# EAGLE schematic agatram128 (EAGLE 7.5.0)
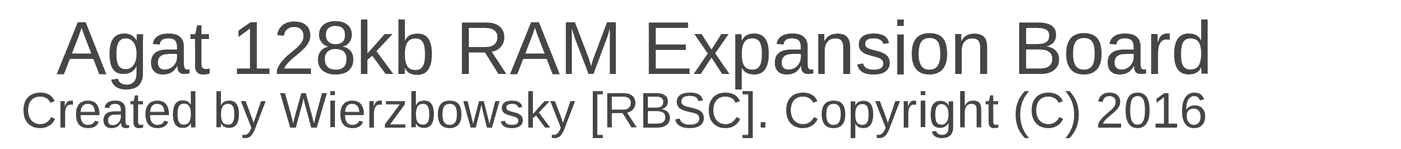
[diagram p0: schematic, sheet 1, part 1 of 3]
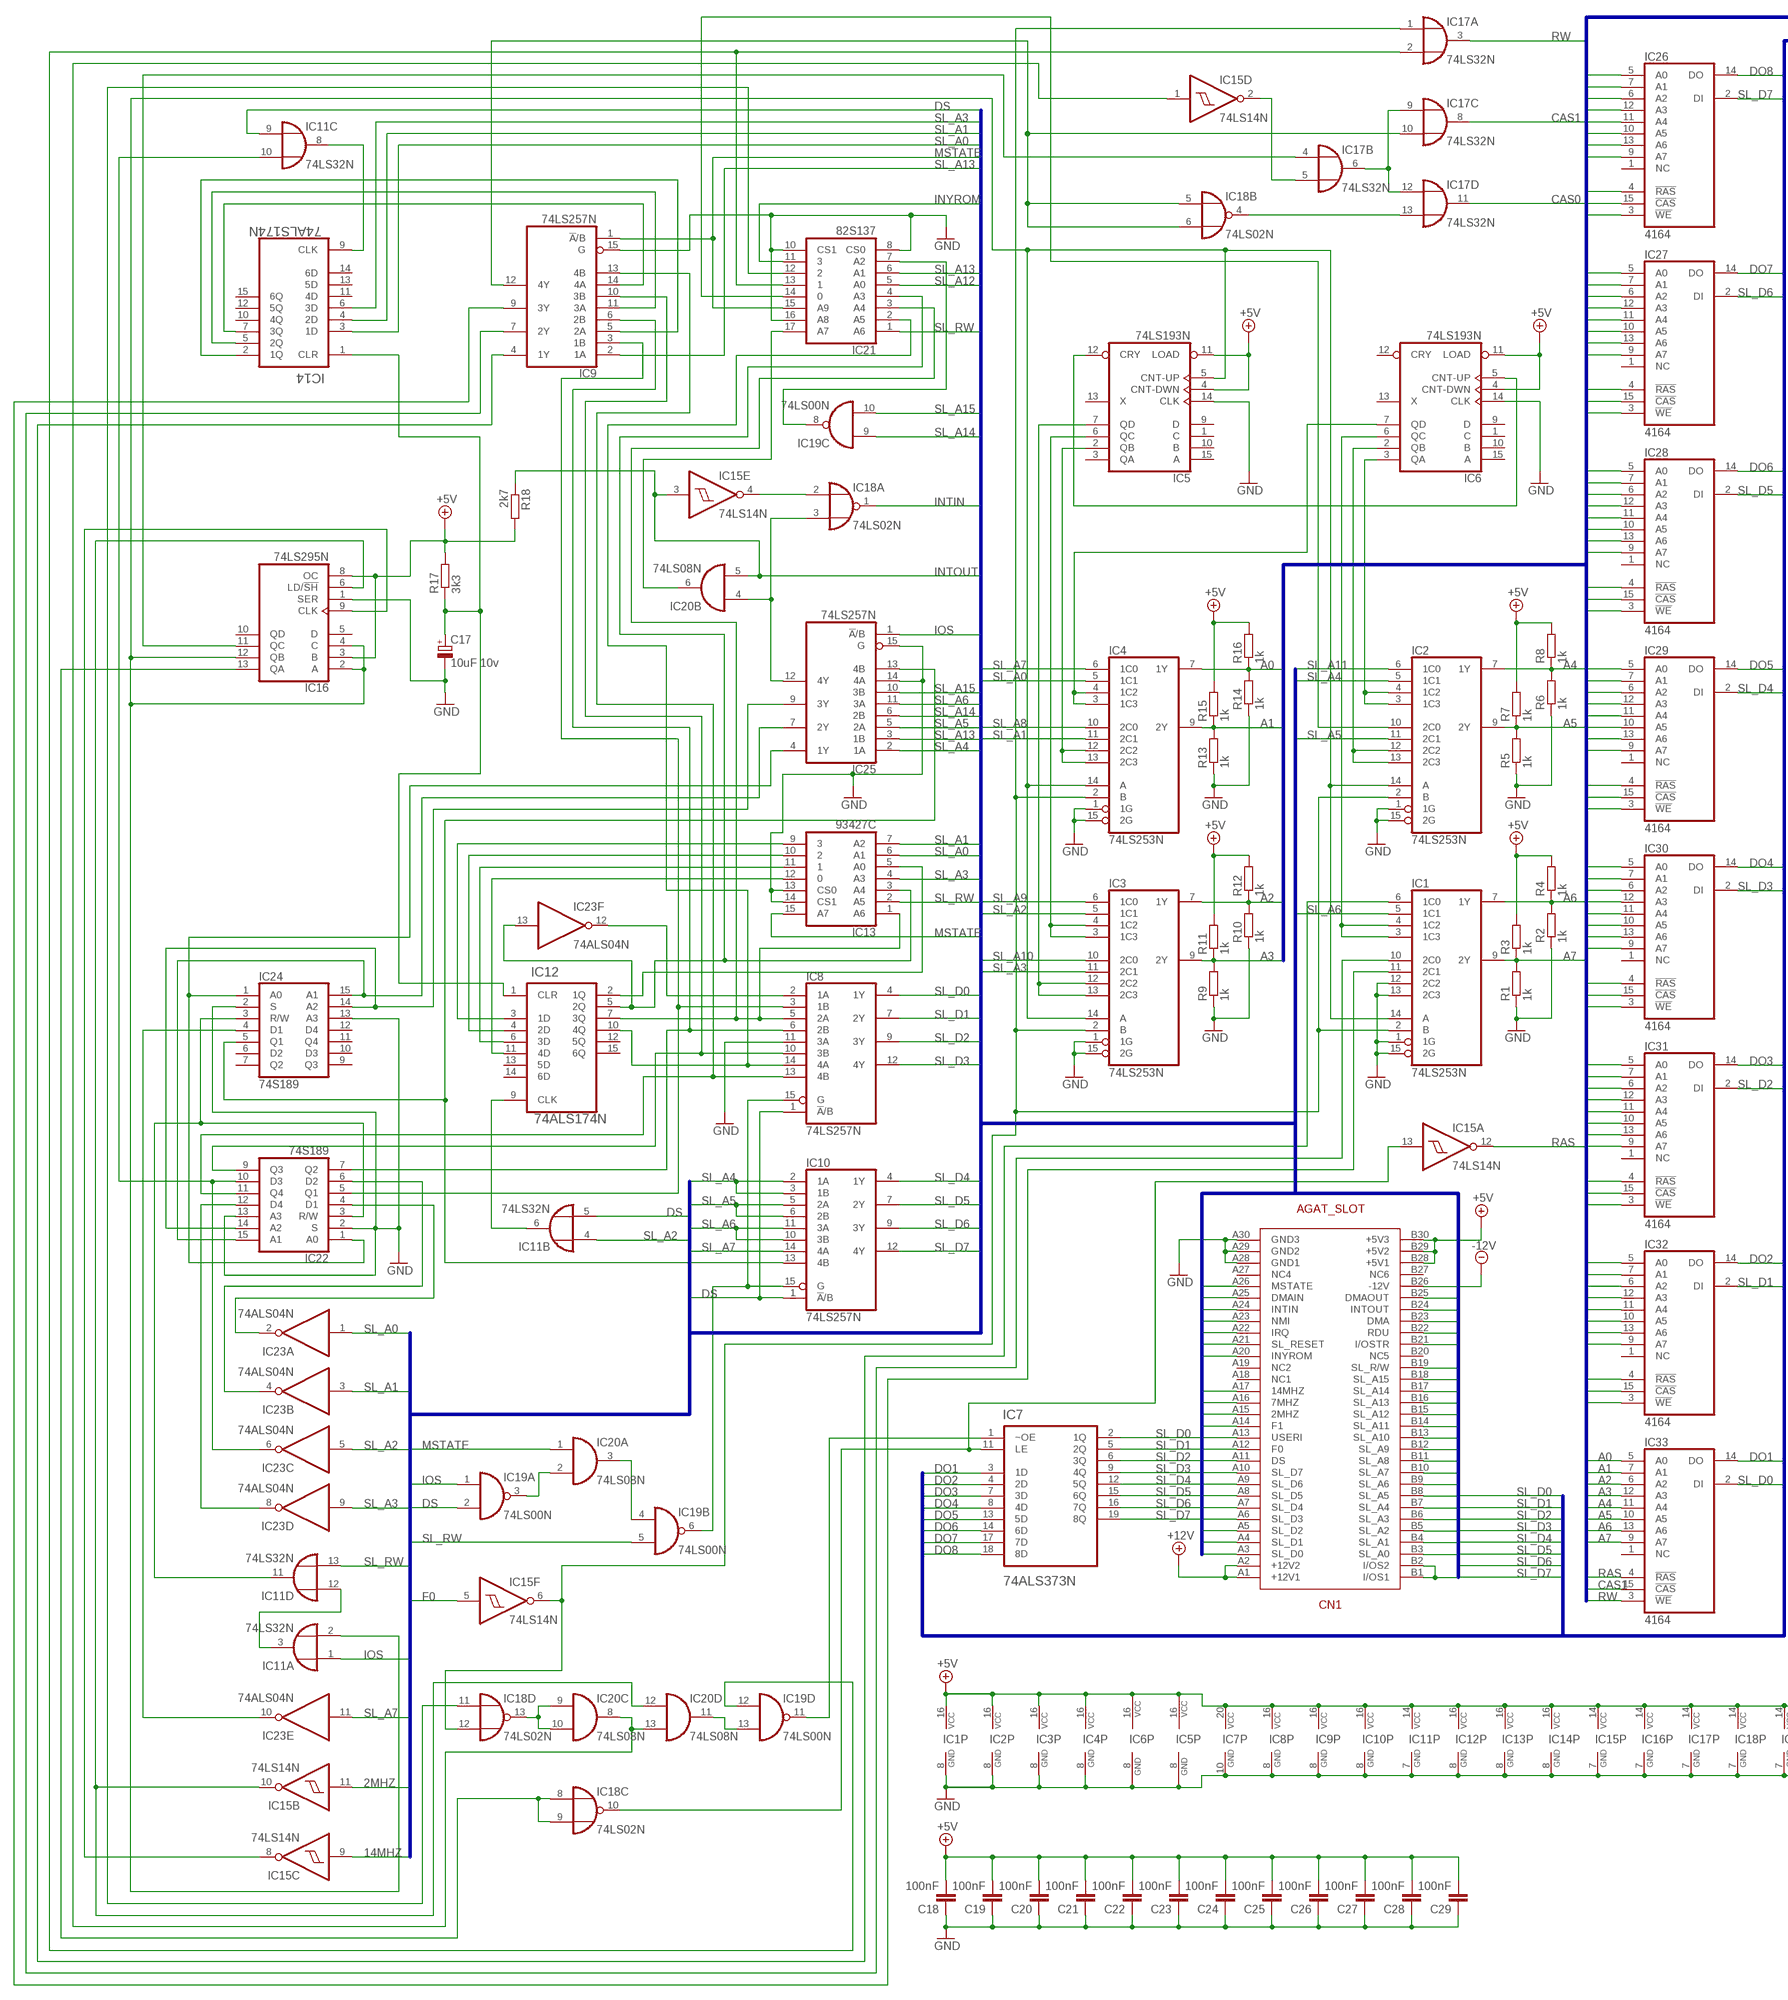
[diagram p1: schematic, sheet 1, part 2 of 3]
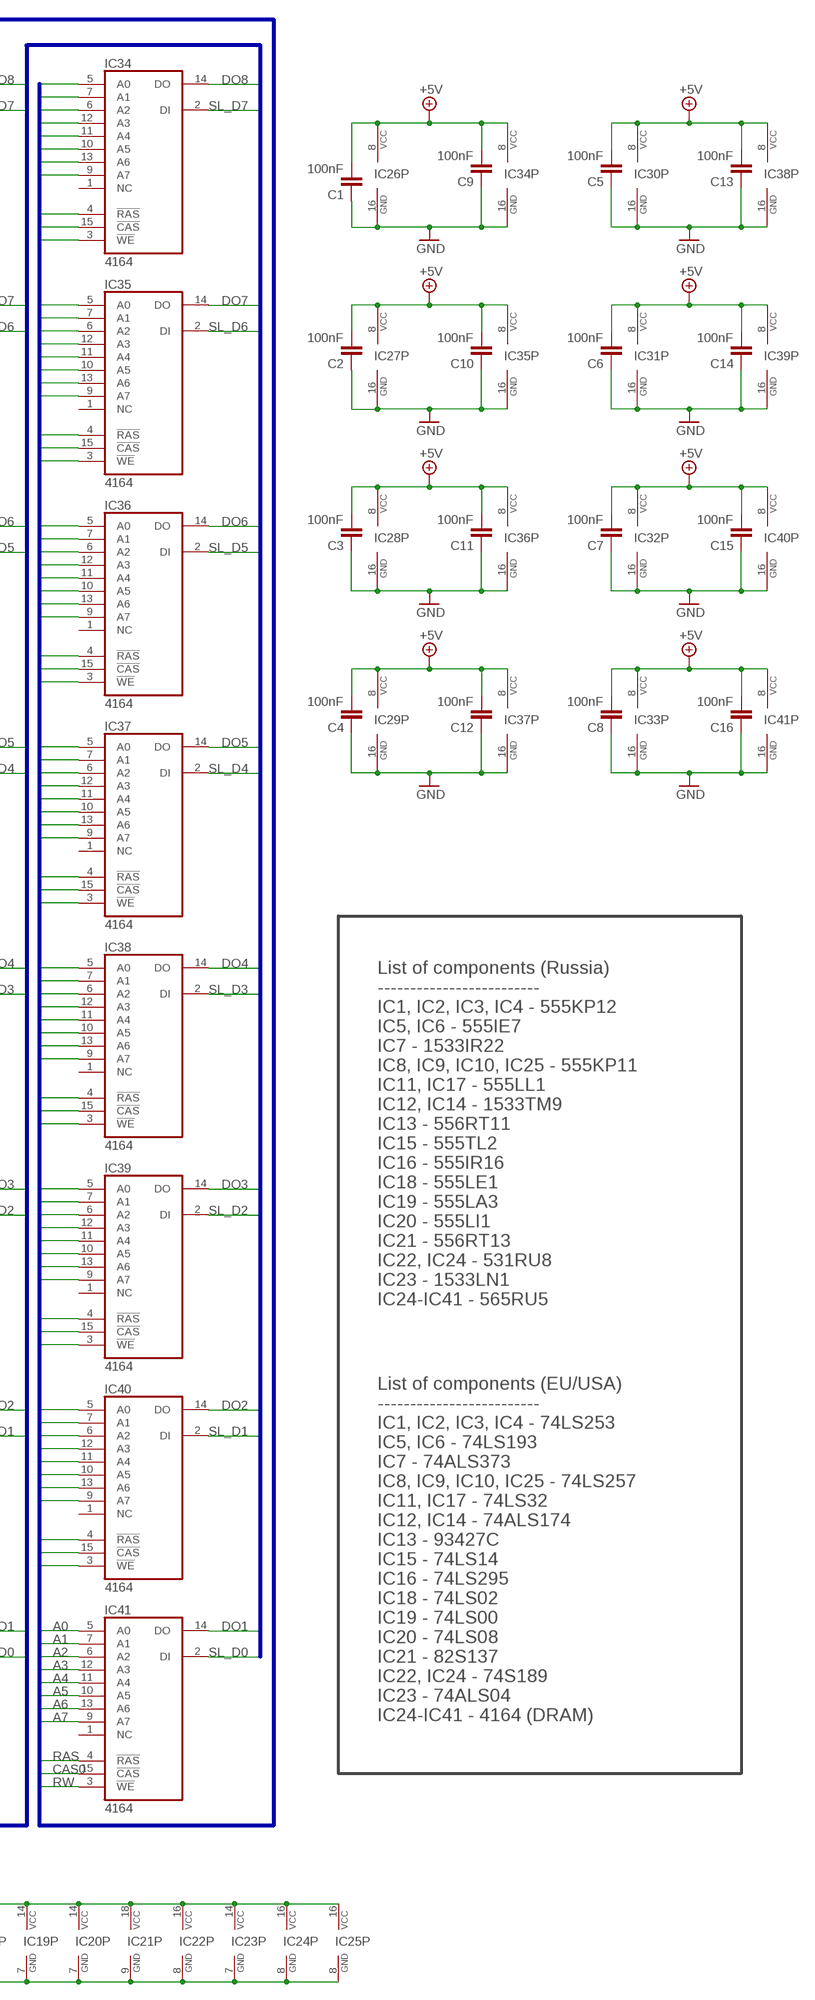
[diagram p2: schematic, sheet 1, part 3 of 3]

## Parts
C1  100nF  C-EU050-025X075  [C050-025X075]
C2  100nF  C-EU050-025X075  [C050-025X075]
C3  100nF  C-EU050-025X075  [C050-025X075]
C4  100nF  C-EU050-025X075  [C050-025X075]
C5  100nF  C-EU050-025X075  [C050-025X075]
C6  100nF  C-EU050-025X075  [C050-025X075]
C7  100nF  C-EU050-025X075  [C050-025X075]
C8  100nF  C-EU050-025X075  [C050-025X075]
C9  100nF  C-EU050-025X075  [C050-025X075]
C10  100nF  C-EU050-025X075  [C050-025X075]
C11  100nF  C-EU050-025X075  [C050-025X075]
C12  100nF  C-EU050-025X075  [C050-025X075]
C13  100nF  C-EU050-025X075  [C050-025X075]
C14  100nF  C-EU050-025X075  [C050-025X075]
C15  100nF  C-EU050-025X075  [C050-025X075]
C16  100nF  C-EU050-025X075  [C050-025X075]
C17  10uF 10v  CPOL-EUE15-5AXIAL  [E15-5]
C18  100nF  C-EU050-025X075  [C050-025X075]
C19  100nF  C-EU050-025X075  [C050-025X075]
C20  100nF  C-EU050-025X075  [C050-025X075]
C21  100nF  C-EU050-025X075  [C050-025X075]
C22  100nF  C-EU050-025X075  [C050-025X075]
C23  100nF  C-EU050-025X075  [C050-025X075]
C24  100nF  C-EU050-025X075  [C050-025X075]
C25  100nF  C-EU050-025X075  [C050-025X075]
C26  100nF  C-EU050-025X075  [C050-025X075]
C27  100nF  C-EU050-025X075  [C050-025X075]
C28  100nF  C-EU050-025X075  [C050-025X075]
C29  100nF  C-EU050-025X075  [C050-025X075]
CN1  AGAT_SLOT  AGAT_CON  [AGAT_CONP]
IC1  74LS253N  [DIL16]
IC2  74LS253N  [DIL16]
IC3  74LS253N  [DIL16]
IC4  74LS253N  [DIL16]
IC5  74LS193N  [DIL16]
IC6  74LS193N  [DIL16]
IC7  74ALS373N  [DIL20]
IC8  74LS257N  [DIL16]
IC9  74LS257N  [DIL16]
IC10  74LS257N  [DIL16]
IC11  74LS32N  [DIL14]
IC12  74ALS174N  [DIL16]
IC13  93427C  [DIL16]
IC14  74ALS174N  [DIL16]
IC15  74LS14N  [DIL14]
IC16  74LS295N  [DIL14]
IC17  74LS32N  [DIL14]
IC18  74LS02N  [DIL14]
IC19  74LS00N  [DIL14]
IC20  74LS08N  [DIL14]
IC21  82S137  [DIL18]
IC22  74S189  [DIL16]
IC23  74ALS04N  [DIL14]
IC24  74S189  [DIL16]
IC25  74LS257N  [DIL16]
IC26  4164  [DIL16]
IC27  4164  [DIL16]
IC28  4164  [DIL16]
IC29  4164  [DIL16]
IC30  4164  [DIL16]
IC31  4164  [DIL16]
IC32  4164  [DIL16]
IC33  4164  [DIL16]
IC34  4164  [DIL16]
IC35  4164  [DIL16]
IC36  4164  [DIL16]
IC37  4164  [DIL16]
IC38  4164  [DIL16]
IC39  4164  [DIL16]
IC40  4164  [DIL16]
IC41  4164  [DIL16]
R1  1k  R-EU_0204/7  [0204/7]
R2  1k  R-EU_0204/7  [0204/7]
R3  1k  R-EU_0204/7  [0204/7]
R4  1k  R-EU_0204/7  [0204/7]
R5  1k  R-EU_0204/7  [0204/7]
R6  1k  R-EU_0204/7  [0204/7]
R7  1k  R-EU_0204/7  [0204/7]
R8  1k  R-EU_0204/7  [0204/7]
R9  1k  R-EU_0204/7  [0204/7]
R10  1k  R-EU_0204/7  [0204/7]
R11  1k  R-EU_0204/7  [0204/7]
R12  1k  R-EU_0204/7  [0204/7]
R13  1k  R-EU_0204/7  [0204/7]
R14  1k  R-EU_0204/7  [0204/7]
R15  1k  R-EU_0204/7  [0204/7]
R16  1k  R-EU_0204/7  [0204/7]
R17  3k3  R-EU_0204/7  [0204/7]
R18  2k7  R-EU_0204/7  [0204/7]

## Nets
2MHZ: CN1.A15(2MHZ) IC15.11(B:I)
7MHZ: CN1.A16(7MHZ)
14MHZ: CN1.A17(14MHZ) IC15.9(C:I)
+5V: C1.2 C2.2 C3.2 C4.2 C5.2 C6.2 C7.2 C8.2 C9.2 C10.2 C11.2 C12.2 C13.2 C14.2 C15.2 C16.2 C18.2 C19.2 C20.2 C21.2 C22.2 C23.2 C24.2 C25.2 C26.2 C27.2 C28.2 C29.2 CN1.B28(+5V1) CN1.B29(+5V2) CN1.B30(+5V3) IC1.16(VCC) IC2.16(VCC) IC3.16(VCC) IC4.16(VCC) IC5.4(CNT-DWN) IC5.11(LOAD) IC5.16(VCC) IC6.4(CNT-DWN) IC6.11(LOAD) IC6.16(VCC) IC7.20(VCC) IC8.16(VCC) IC9.16(VCC) IC10.16(VCC) IC11.14(P:VCC) IC12.16(VCC) IC13.16(VCC) IC14.16(VCC) IC15.14(P:VCC) IC16.3(B) IC16.8(OC) IC16.14(VCC) IC17.14(P:VCC) IC18.14(P:VCC) IC19.14(P:VCC) IC20.14(P:VCC) IC21.18(VCC) IC22.16(VCC) IC23.14(P:VCC) IC24.16(VCC) IC25.16(VCC) IC26.8(VCC) IC27.8(VCC) IC28.8(VCC) IC29.8(VCC) IC30.8(VCC) IC31.8(VCC) IC32.8(VCC) IC33.8(VCC) IC34.8(VCC) IC35.8(VCC) IC36.8(VCC) IC37.8(VCC) IC38.8(VCC) IC39.8(VCC) IC40.8(VCC) IC41.8(VCC) R3.2 R4.2 R7.2 R8.2 R11.2 R12.2 R15.2 R16.2 R17.2 R18.2
+12V: CN1.A1(+12V1) CN1.A2(+12V2)
-12V: CN1.B26(-12V)
A0: IC4.7(1Y) IC26.5(A0) IC27.5(A0) IC28.5(A0) IC29.5(A0) IC30.5(A0) IC31.5(A0) IC32.5(A0) IC33.5(A0) IC34.5(A0) IC35.5(A0) IC36.5(A0) IC37.5(A0) IC38.5(A0) IC39.5(A0) IC40.5(A0) IC41.5(A0) R14.2 R16.1
A1: IC4.9(2Y) IC26.7(A1) IC27.7(A1) IC28.7(A1) IC29.7(A1) IC30.7(A1) IC31.7(A1) IC32.7(A1) IC33.7(A1) IC34.7(A1) IC35.7(A1) IC36.7(A1) IC37.7(A1) IC38.7(A1) IC39.7(A1) IC40.7(A1) IC41.7(A1) R13.2 R15.1
A2: IC3.7(1Y) IC26.6(A2) IC27.6(A2) IC28.6(A2) IC29.6(A2) IC30.6(A2) IC31.6(A2) IC32.6(A2) IC33.6(A2) IC34.6(A2) IC35.6(A2) IC36.6(A2) IC37.6(A2) IC38.6(A2) IC39.6(A2) IC40.6(A2) IC41.6(A2) R10.2 R12.1
A3: IC3.9(2Y) IC26.12(A3) IC27.12(A3) IC28.12(A3) IC29.12(A3) IC30.12(A3) IC31.12(A3) IC32.12(A3) IC33.12(A3) IC34.12(A3) IC35.12(A3) IC36.12(A3) IC37.12(A3) IC38.12(A3) IC39.12(A3) IC40.12(A3) IC41.12(A3) R9.2 R11.1
A4: IC2.7(1Y) IC26.11(A4) IC27.11(A4) IC28.11(A4) IC29.11(A4) IC30.11(A4) IC31.11(A4) IC32.11(A4) IC33.11(A4) IC34.11(A4) IC35.11(A4) IC36.11(A4) IC37.11(A4) IC38.11(A4) IC39.11(A4) IC40.11(A4) IC41.11(A4) R6.2 R8.1
A5: IC2.9(2Y) IC26.10(A5) IC27.10(A5) IC28.10(A5) IC29.10(A5) IC30.10(A5) IC31.10(A5) IC32.10(A5) IC33.10(A5) IC34.10(A5) IC35.10(A5) IC36.10(A5) IC37.10(A5) IC38.10(A5) IC39.10(A5) IC40.10(A5) IC41.10(A5) R5.2 R7.1
A6: IC1.7(1Y) IC26.13(A6) IC27.13(A6) IC28.13(A6) IC29.13(A6) IC30.13(A6) IC31.13(A6) IC32.13(A6) IC33.13(A6) IC34.13(A6) IC35.13(A6) IC36.13(A6) IC37.13(A6) IC38.13(A6) IC39.13(A6) IC40.13(A6) IC41.13(A6) R2.2 R4.1
A7: IC1.9(2Y) IC26.9(A7) IC27.9(A7) IC28.9(A7) IC29.9(A7) IC30.9(A7) IC31.9(A7) IC32.9(A7) IC33.9(A7) IC34.9(A7) IC35.9(A7) IC36.9(A7) IC37.9(A7) IC38.9(A7) IC39.9(A7) IC40.9(A7) IC41.9(A7) R1.2 R3.1
CAS0: IC17.11(D:O) IC34.15(!CAS) IC35.15(!CAS) IC36.15(!CAS) IC37.15(!CAS) IC38.15(!CAS) IC39.15(!CAS) IC40.15(!CAS) IC41.15(!CAS)
CAS1: IC17.8(C:O) IC26.15(!CAS) IC27.15(!CAS) IC28.15(!CAS) IC29.15(!CAS) IC30.15(!CAS) IC31.15(!CAS) IC32.15(!CAS) IC33.15(!CAS)
DMA: CN1.B23(DMA)
DMAIN: CN1.A25(DMAIN)
DMAOUT: CN1.B25(DMAOUT)
DO1: IC7.3(1D) IC33.14(DO) IC41.14(DO)
DO2: IC7.4(2D) IC32.14(DO) IC40.14(DO)
DO3: IC7.7(3D) IC31.14(DO) IC39.14(DO)
DO4: IC7.8(4D) IC30.14(DO) IC38.14(DO)
DO5: IC7.13(5D) IC29.14(DO) IC37.14(DO)
DO6: IC7.14(6D) IC28.14(DO) IC36.14(DO)
DO7: IC7.17(7D) IC27.14(DO) IC35.14(DO)
DO8: IC7.18(8D) IC26.14(DO) IC34.14(DO)
DS: CN1.A11(DS) IC8.1(!A!/B) IC10.1(!A!/B) IC11.5(B:I1) IC11.9(C:I0) IC19.2(A:I1)
F0: CN1.A12(F0) IC15.5(F:I)
F1: CN1.A14(F1)
GND: C1.1 C2.1 C3.1 C4.1 C5.1 C6.1 C7.1 C8.1 C9.1 C10.1 C11.1 C12.1 C13.1 C14.1 C15.1 C16.1 C17.- C18.1 C19.1 C20.1 C21.1 C22.1 C23.1 C24.1 C25.1 C26.1 C27.1 C28.1 C29.1 CN1.A28(GND1) CN1.A29(GND2) CN1.A30(GND3) IC1.1(1G) IC1.8(GND) IC1.12(2C2) IC1.13(2C3) IC1.15(2G) IC2.1(1G) IC2.8(GND) IC2.15(2G) IC3.1(1G) IC3.8(GND) IC3.15(2G) IC4.1(1G) IC4.8(GND) IC4.15(2G) IC5.8(GND) IC5.14(CLK) IC6.8(GND) IC6.14(CLK) IC7.10(GND) IC8.8(GND) IC8.11(3A) IC9.8(GND) IC9.15(G) IC10.8(GND) IC11.7(P:GND) IC12.8(GND) IC13.8(GND) IC13.13(CS0) IC13.14(CS1) IC14.8(GND) IC15.7(P:GND) IC16.1(SER) IC16.7(GND) IC17.7(P:GND) IC18.7(P:GND) IC19.7(P:GND) IC20.7(P:GND) IC21.8(CS0) IC21.9(GND) IC21.10(CS1) IC21.16(A8) IC22.2(S) IC22.8(GND) IC22.13(A3) IC23.7(P:GND) IC24.2(S) IC24.8(GND) IC24.13(A3) IC25.8(GND) IC25.14(4A) IC25.15(G) IC26.16(GND) IC27.16(GND) IC28.16(GND) IC29.16(GND) IC30.16(GND) IC31.16(GND) IC32.16(GND) IC33.16(GND) IC34.16(GND) IC35.16(GND) IC36.16(GND) IC37.16(GND) IC38.16(GND) IC39.16(GND) IC40.16(GND) IC41.16(GND) R1.1 R2.1 R5.1 R6.1 R9.1 R10.1 R13.1 R14.1
INTIN: CN1.A24(INTIN) IC18.1(A:O)
INTOUT: CN1.B24(INTOUT) IC15.3(E:I) IC20.5(B:I1) R18.1
INYROM: CN1.A20(INYROM) IC21.11
IOS: CN1.B1(I/OS1) CN1.B2(I/OS2) IC11.1(A:I0) IC19.1(A:I0) IC25.1(!A!/B)
IOSTR: CN1.B21(I/OSTR)
IRQ: CN1.A22(IRQ)
MSTATE: CN1.A26(MSTATE) IC9.1(!A!/B) IC13.15(A7) IC20.1(A:I0) IC21.15(A9)
N$1: IC17.6(B:O) IC17.9(C:I0) IC17.12(D:I0)
N$2: IC7.1(~OE) IC19.11(D:O)
N$3: IC7.11(LE) IC15.13(A:I) IC18.10(C:O)
N$4: IC19.8(C:O) IC21.7(A2)
N$5: IC8.15(G) IC10.15(G) IC19.6(B:O)
N$6: IC11.6(B:O) IC12.9(CLK)
N$7: IC12.2(1Q) IC13.5(A0)
N$8: IC12.5(2Q) IC13.3(A4) IC21.4(A3) IC23.13(F:I)
N$9: IC8.5(2A) IC12.7(3Q) IC13.1(A6) IC21.3(A4)
N$10: IC12.6(3D) IC13.11
N$11: IC8.14(4A) IC12.10(4Q) IC21.2(A5)
N$12: IC12.11(4D) IC13.12
N$13: IC12.4(2D) IC13.10
N$14: IC12.3(1D) IC13.9
N$15: IC9.14(4A) IC14.7(3Q)
N$16: IC8.2(1A) IC23.12(F:O)
N$17: IC9.11(3A) IC14.5(2Q)
N$18: IC9.5(2A) IC14.2(1Q)
N$19: IC2.10(2C0) IC21.14
N$20: IC22.4(D1) IC23.2(A:O)
N$21: IC22.6(D2) IC23.4(B:O)
N$22: IC11.10(C:I1) IC22.10(D3) IC23.6(C:O)
N$23: IC22.12(D4) IC23.8(D:O)
N$24: IC22.14(A2) IC24.14(A2) IC25.9(3Y)
N$25: IC11.11(D:O) IC22.3(R/W) IC24.3(R/W)
N$26: IC18.3(A:I1) IC20.4(B:I0) IC25.12(4Y)
N$27: IC11.8(C:O) IC14.9(CLK)
N$28: IC11.3(A:O) IC11.12(D:I0)
N$29: IC23.10(E:O) IC24.4(D1)
N$30: IC19.4(B:I0) IC20.3(A:O)
N$31: IC19.3(A:O) IC20.2(A:I1)
N$32: IC22.1(A0) IC24.1(A0) IC25.4(1Y)
N$33: IC10.13(4B) IC24.5(Q1) IC25.13(4B)
N$34: IC22.15(A1) IC24.15(A1) IC25.7(2Y)
N$35: IC15.2(D:O) IC17.5(B:I1)
N$36: IC4.12(2C2) IC4.13(2C3) IC5.2(QB)
N$37: IC3.3(1C3) IC3.4(1C2) IC5.6(QC)
N$38: IC3.12(2C2) IC3.13(2C3) IC5.7(QD)
N$39: IC5.12(CRY) IC6.5(CNT-UP)
N$40: IC2.3(1C3) IC2.4(1C2) IC6.3(QA)
N$41: IC2.12(2C2) IC2.13(2C3) IC6.2(QB)
N$42: IC1.3(1C3) IC1.4(1C2) IC6.6(QC)
N$43: IC4.3(1C3) IC4.4(1C2) IC6.7(QD)
N$44: IC1.2(B) IC2.2(B) IC3.2(B) IC4.2(B) IC15.6(F:O) IC17.1(A:I0) IC18.12(D:I1)
N$45: IC18.13(D:O) IC20.9(C:I0) IC20.10(C:I1)
N$46: IC18.11(D:I0) IC21.12
N$47: IC15.1(D:I) IC20.8(C:O) IC20.13(D:I1)
N$48: IC19.13(D:I1) IC20.11(D:O)
N$49: IC15.10(B:O) IC16.6(LD/!SH) IC20.12(D:I0)
N$50: IC15.8(C:O) IC16.9(CLK)
N$51: IC1.14(A) IC2.14(A) IC3.14(A) IC4.14(A) IC5.5(CNT-UP) IC11.2(A:I1) IC16.2(A) IC16.4(C) IC16.12(QB)
N$52: IC16.11(QC) IC17.4(B:I0)
N$53: IC17.2(A:I1) IC19.12(D:I0) IC21.13
N$54: IC16.13(QA) IC18.8(C:I0) IC18.9(C:I1)
N$55: IC15.4(E:O) IC18.2(A:I0)
N$56: IC20.6(B:O) IC21.17(A7)
N$57: IC17.13(D:I1) IC18.4(B:O)
N$58: IC9.12(4Y) IC17.10(C:I1) IC18.5(B:I0) IC18.6(B:I1)
N$59: IC1.6(1C0) IC9.4(1Y)
N$60: IC1.10(2C0) IC9.7(2Y)
N$61: IC1.11(2C1) IC9.9(3Y)
N$63: IC8.3(1B) IC9.3(1B) IC22.5(Q1)
N$64: IC8.6(2B) IC9.6(2B) IC22.7(Q2)
N$65: IC8.10(3B) IC9.10(3B) IC22.9(Q3)
N$66: IC8.13(4B) IC9.13(4B) IC22.11(Q4)
NMI: CN1.A23(NMI)
RAS: IC15.12(A:O) IC26.4(!RAS) IC27.4(!RAS) IC28.4(!RAS) IC29.4(!RAS) IC30.4(!RAS) IC31.4(!RAS) IC32.4(!RAS) IC33.4(!RAS) IC34.4(!RAS) IC35.4(!RAS) IC36.4(!RAS) IC37.4(!RAS) IC38.4(!RAS) IC39.4(!RAS) IC40.4(!RAS) IC41.4(!RAS)
RDU: CN1.B22(RDU)
RES: C17.+ IC12.1(CLR) IC14.1(CLR) R17.1
RW: IC17.3(A:O) IC26.3(!WE) IC27.3(!WE) IC28.3(!WE) IC29.3(!WE) IC30.3(!WE) IC31.3(!WE) IC32.3(!WE) IC33.3(!WE) IC34.3(!WE) IC35.3(!WE) IC36.3(!WE) IC37.3(!WE) IC38.3(!WE) IC39.3(!WE) IC40.3(!WE) IC41.3(!WE)
SL_A0: CN1.B3(SL_A0) IC4.5(1C1) IC13.6(A1) IC14.3(1D) IC23.1(A:I)
SL_A1: CN1.B4(SL_A1) IC4.11(2C1) IC13.7(A2) IC14.4(2D) IC23.3(B:I)
SL_A2: CN1.B5(SL_A2) IC3.5(1C1) IC11.4(B:I0) IC23.5(C:I)
SL_A3: CN1.B6(SL_A3) IC3.11(2C1) IC13.4(A3) IC14.6(3D) IC23.9(D:I)
SL_A4: CN1.B7(SL_A4) IC2.5(1C1) IC10.2(1A) IC10.3(1B) IC25.2(1A)
SL_A5: CN1.B8(SL_A5) IC2.11(2C1) IC10.5(2A) IC10.6(2B) IC25.5(2A)
SL_A6: CN1.B9(SL_A6) IC1.5(1C1) IC10.10(3B) IC10.11(3A) IC25.11(3A)
SL_A7: CN1.B10(SL_A7) IC4.6(1C0) IC10.14(4A) IC23.11(E:I)
SL_A8: CN1.B11(SL_A8) IC4.10(2C0)
SL_A9: CN1.B12(SL_A9) IC3.6(1C0)
SL_A10: CN1.B13(SL_A10) IC3.10(2C0)
SL_A11: CN1.B14(SL_A11) IC2.6(1C0)
SL_A12: CN1.B15(SL_A12) IC21.5(A0)
SL_A13: CN1.B16(SL_A13) IC9.2(1A) IC21.6(A1) IC25.3(1B)
SL_A14: CN1.B17(SL_A14) IC19.9(C:I0) IC25.6(2B)
SL_A15: CN1.B18(SL_A15) IC19.10(C:I1) IC25.10(3B)
SL_D0: CN1.A3(SL_D0) IC7.2(1Q) IC8.4(1Y) IC33.2(DI) IC41.2(DI)
SL_D1: CN1.A4(SL_D1) IC7.5(2Q) IC8.7(2Y) IC32.2(DI) IC40.2(DI)
SL_D2: CN1.A5(SL_D2) IC7.6(3Q) IC8.9(3Y) IC31.2(DI) IC39.2(DI)
SL_D3: CN1.A6(SL_D3) IC7.9(4Q) IC8.12(4Y) IC30.2(DI) IC38.2(DI)
SL_D4: CN1.A7(SL_D4) IC7.12(5Q) IC10.4(1Y) IC29.2(DI) IC37.2(DI)
SL_D5: CN1.A8(SL_D5) IC7.15(6Q) IC10.7(2Y) IC28.2(DI) IC36.2(DI)
SL_D6: CN1.A9(SL_D6) IC7.16(7Q) IC10.9(3Y) IC27.2(DI) IC35.2(DI)
SL_D7: CN1.A10(SL_D7) IC7.19(8Q) IC10.12(4Y) IC26.2(DI) IC34.2(DI)
SL_RESET: CN1.A21(SL_RESET)
SL_RW: CN1.B19(SL_R/W) IC11.13(D:I1) IC13.2(A5) IC19.5(B:I1) IC21.1(A6)
USERI: CN1.A13(USERI)
Unconnected: CN1.A18(NC1) CN1.A19(NC2) CN1.A27(NC4) CN1.B20(NC5) CN1.B27(NC6) IC5.1(C) IC5.3(QA) IC5.9(D) IC5.10(B) IC5.13(X) IC5.15(A) IC6.1(C) IC6.9(D) IC6.10(B) IC6.12(CRY) IC6.13(X) IC6.15(A) IC12.12(5Q) IC12.13(5D) IC12.14(6D) IC12.15(6Q) IC14.10(4Q) IC14.11(4D) IC14.12(5Q) IC14.13(5D) IC14.14(6D) IC14.15(6Q) IC16.5(D) IC16.10(QD) IC24.6(D2) IC24.7(Q2) IC24.9(Q3) IC24.10(D3) IC24.11(Q4) IC24.12(D4) IC26.1(NC) IC27.1(NC) IC28.1(NC) IC29.1(NC) IC30.1(NC) IC31.1(NC) IC32.1(NC) IC33.1(NC) IC34.1(NC) IC35.1(NC) IC36.1(NC) IC37.1(NC) IC38.1(NC) IC39.1(NC) IC40.1(NC) IC41.1(NC)

## Buses
A0,A1,A2,A3,A4,A5,A6,A7,RAS,RW,CAS0,CAS1
DMAIN,INTIN,NMI,IRQ,SL_RESET,INYROM,14MHZ,7MHZ,2MHZ,F1,USERI,F0,DS,SL_D0,SL_D1,SL_D2,SL_D3,SL_D4,SL_D5,SL_D6,SL_D7,IOS,SL_A0,SL_A1,SL_A2,SL_A3,SL_A4,SL_A5,SL_A6,SL_A7,SL_A8,SL_A9,SL_A10,SL_A11,SL_A12,SL_A13,SL_A14,SL_A15,SL_RW,IOSTR,RDU,DMA,INTOUT,DMAOUT,MSTATE
DO1,DO2,DO3,DO4,DO5,DO6,DO7,DO8,SL_D0,SL_D1,SL_D2,SL_D3,SL_D4,SL_D5,SL_D6,SL_D7
SL_A0,SL_A1,SL_A2,SL_A3,SL_A4,SL_A5,SL_A6,SL_A7,SL_A8,SL_A9,SL_A10,SL_A11,SL_A12,SL_A13,SL_A14,SL_A15

## Notes on the sheet
- Agat 128kb RAM Expansion Board
- Created by Wierzbowsky [RBSC]. Copyright (C) 2016
- List of components (Russia)
  -------------------------
  IC1, IC2, IC3, IC4 - 555KP12
  IC5, IC6 - 555IE7
  IC7 - 1533IR22
  IC8, IC9, IC10, IC25 - 555KP11
  IC11, IC17 - 555LL1
  IC12, IC14 - 1533TM9
  IC13 - 556RT11
  IC15 - 555TL2
  IC16 - 555IR16
  IC18 - 555LE1
  IC19 - 555LA3
  IC20 - 555LI1
  IC21 - 556RT13
  IC22, IC24 - 531RU8
  IC23 - 1533LN1
  IC24-IC41 - 565RU5
- List of components (EU/USA)
  -------------------------
  IC1, IC2, IC3, IC4 - 74LS253
  IC5, IC6 - 74LS193
  IC7 - 74ALS373
  IC8, IC9, IC10, IC25 - 74LS257
  IC11, IC17 - 74LS32
  IC12, IC14 - 74ALS174
  IC13 - 93427C
  IC15 - 74LS14
  IC16 - 74LS295
  IC18 - 74LS02
  IC19 - 74LS00
  IC20 - 74LS08
  IC21 - 82S137
  IC22, IC24 - 74S189
  IC23 - 74ALS04
  IC24-IC41 - 4164 (DRAM)

## Library data of the parts
C1-C16 C18-C29 = rcl:C-EU: CAPACITOR, European symbol
C17 = rcl:CPOL-EU: POLARIZED CAPACITOR, European symbol
CN1 = AGAT_Slot_Connector:AGAT_CON
IC1-IC4 = 74xx-eu:74*253: Dual 4-to 1 line data SELECTOR/MULTIPLEXER, 3-state
IC5 IC6 = 0RB_TTL:74*193: Synchronous UP/DOWN COUNTER
IC7 = 74ALS373:74ALS373N: 74ALS373
IC8-IC10 IC25 = 74xx-eu:74*257: Quadruple 2-to 1 line data SELECTOR/MULTIPLEXER
IC11 IC17 = 74xx-eu:74*32: Quad 2-input OR gate
IC12 IC14 = 74ALS174:74ALS174N: 74ALS174
IC13 = 93427C:93427C: 93427C
IC15 = 74xx-eu:74*14: Hex schmitt trigger INVERTER
IC16 = 74LS295:74LS295: 74LS295
IC18 = 74xx-eu:74*02: Quad 2-input NOR gate
IC19 = 74xx-eu:74*00: Quad 2-input NAND gate
IC20 = 74xx-eu:74*08: Quad 2-input AND gate
IC21 = 82S137:82S137: 82S137
IC22 IC24 = 74S189:74S189: 74S189
IC23 = 74xx-eu:74*04: Hex INVERTER
IC26-IC41 = 0RB_Memory:4164: MEMORY
R1-R18 = rcl:R-EU_: RESISTOR, European symbol